# EAGLE design 611_jetbot (EAGLE 9.2.2)
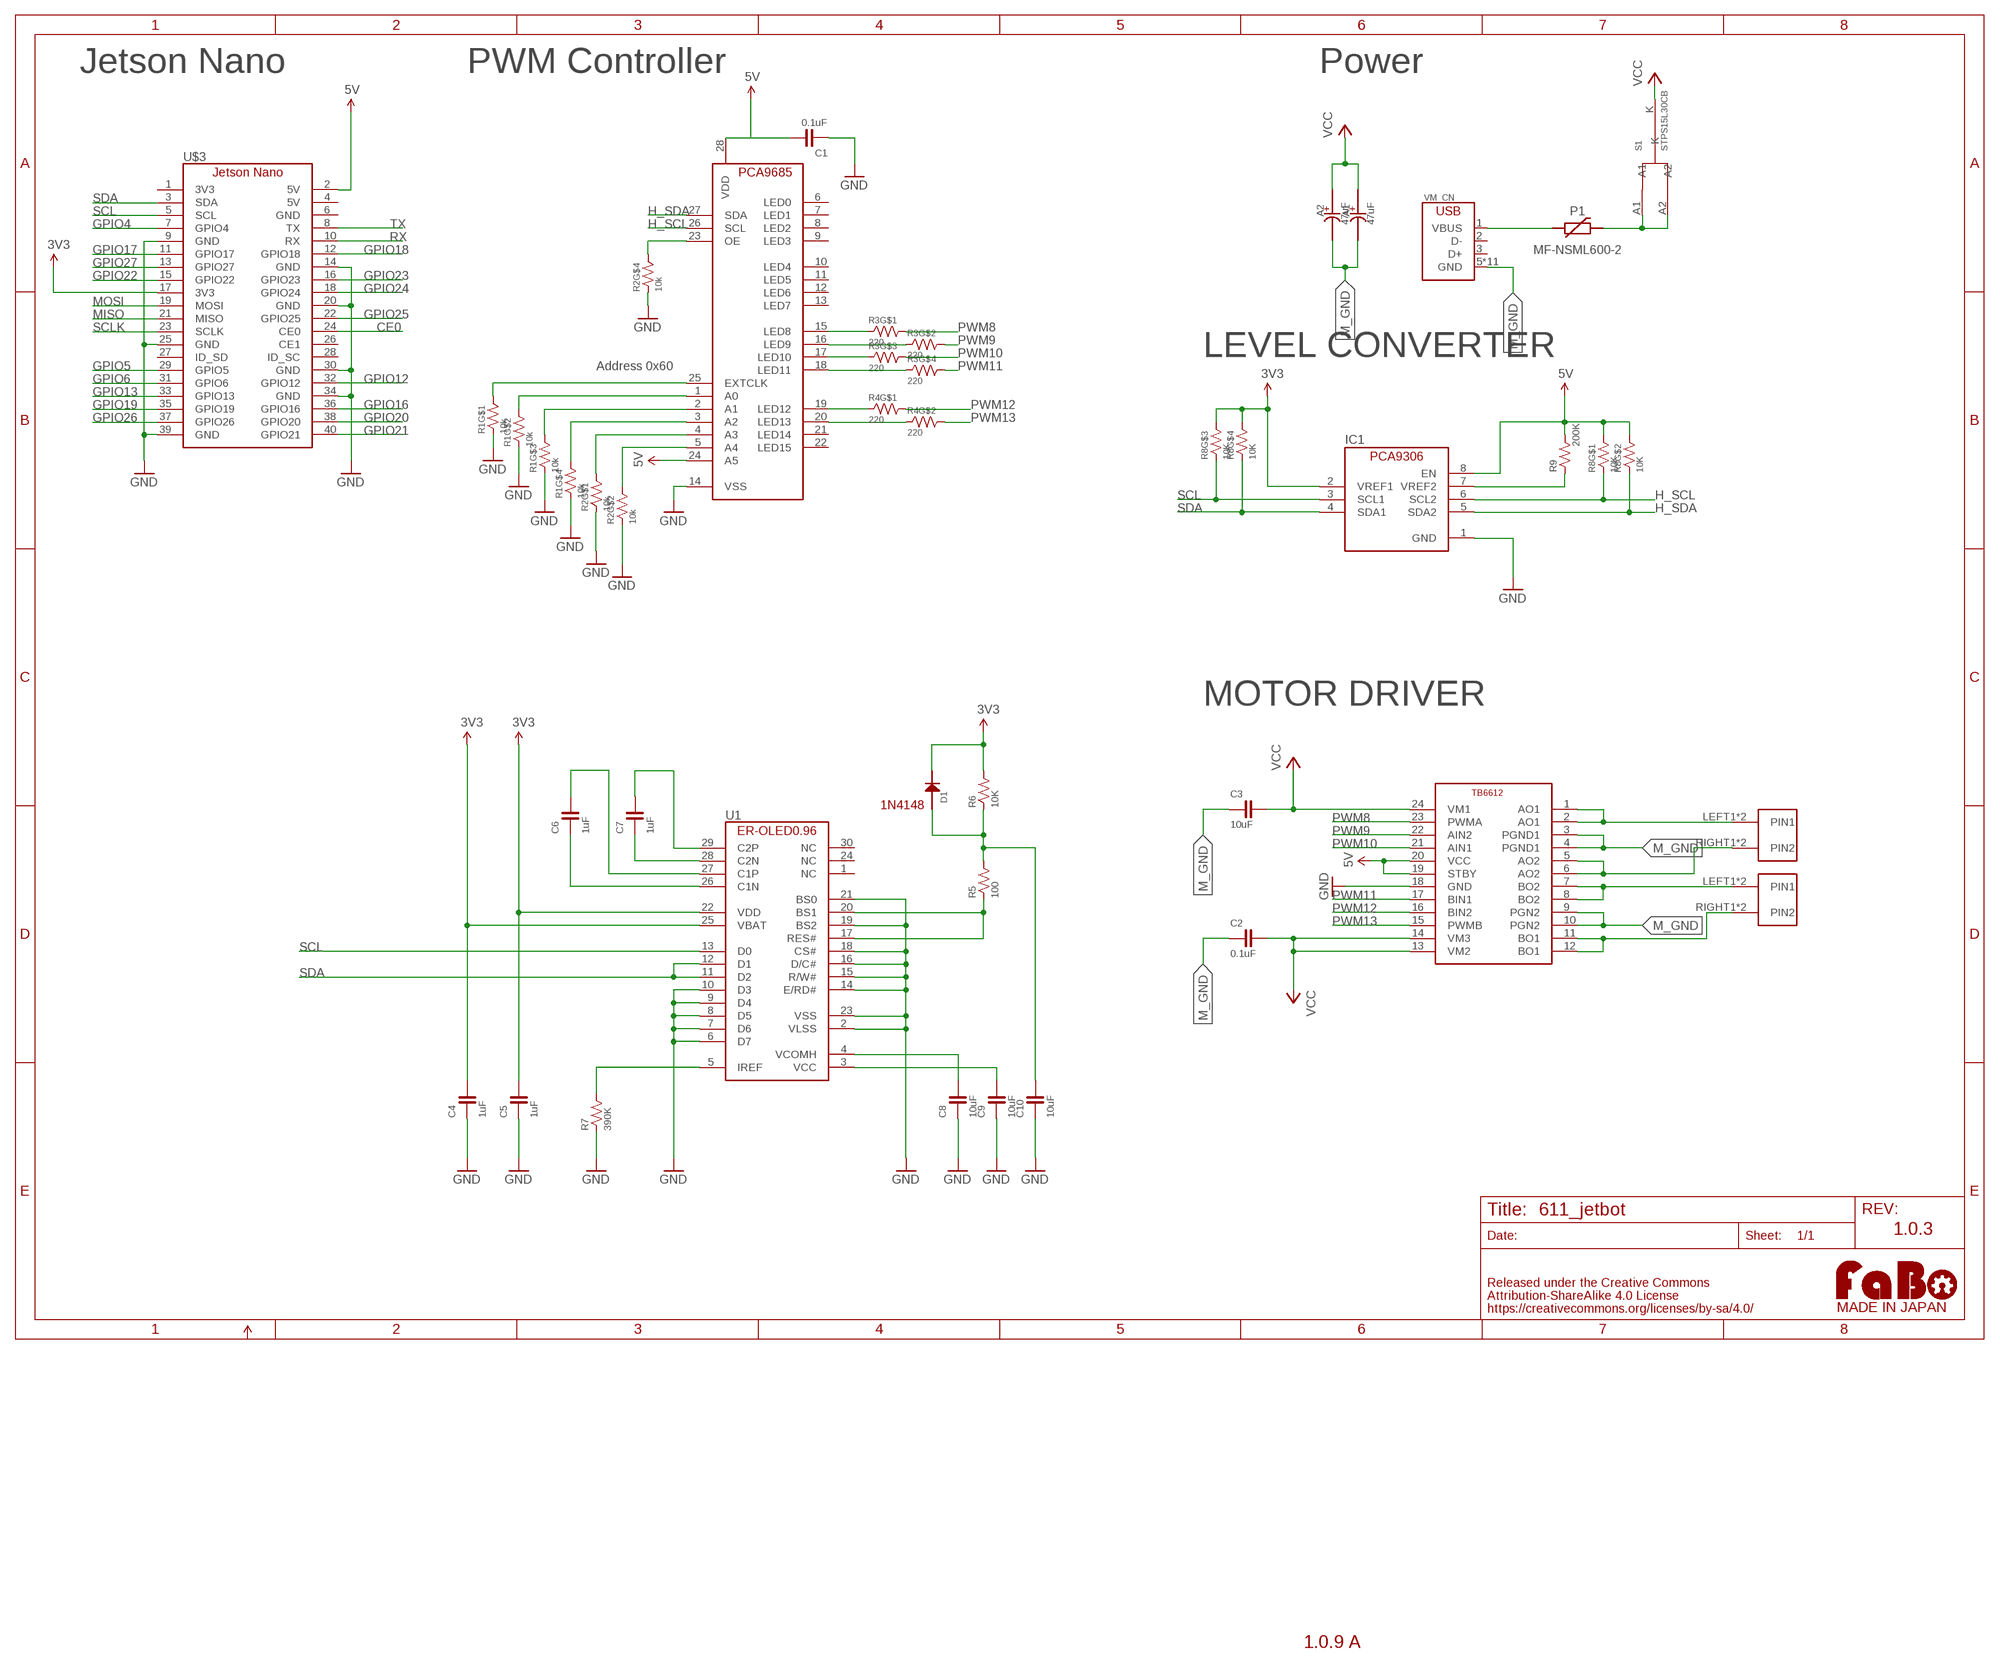
[diagram p0: schematic, sheet 1]

## Parts
A1  47uF  CAPACITOR-ALUMIN_D60  [D60]
A2  47uF  CAPACITOR-ALUMIN_D60  [D60]
C1  0.1uF  CAPACITOR-0603  [0603]
C2  0.1uF  CAPACITOR-0603  [0603]
C3  10uF  CAPACITOR-0603  [0603]
C4  1uF  CAPACITOR-0603-BOTTOM  [0603-BOTTOM]
C5  1uF  CAPACITOR-0603-BOTTOM  [0603-BOTTOM]
C6  1uF  CAPACITOR-0603-BOTTOM  [0603-BOTTOM]
C7  1uF  CAPACITOR-0603-BOTTOM  [0603-BOTTOM]
C8  10uF  CAPACITOR-0603-BOTTOM  [0603-BOTTOM]
C9  10uF  CAPACITOR-0603-BOTTOM  [0603-BOTTOM]
C10  10uF  CAPACITOR-0603-BOTTOM  [0603-BOTTOM]
D1  1N4148  [1N4148W]
IC1  PCA9306_SSOP  [8PIN-SSOP]
P1  MF-NSML600-2  POLYSWITCH1206  [1206]
R1  10k  RESISTOR_ARRAY  [EXBV8V]
R2  10k  RESISTOR_ARRAY  [EXBV8V]
R3  220  RESISTOR_ARRAY  [EXBV8V]
R4  220  RESISTOR_ARRAY  [EXBV8V]
R5  100  RESISTOR-0603-BOTTOM  [0603-BOTTOM]
R6  10K  RESISTOR-0603-BOTTOM  [0603-BOTTOM]
R7  390K  RESISTOR-0603-BOTTOM  [0603-BOTTOM]
R8  10K  RESISTOR_ARRAY  [EXBV8V]
R9  200K  RESISTOR-0603  [0603]
S1  STPS15L30CB  STPS15L30C  [STPS15L30C]
U1  ER-OLED0.96-1ER-CON30HT-1  [ER-CON30HT-1]
U$3  JETSON_NANO  [JETSON_NANO]
U$5  TB6612  [TB6612]
U$6  ML-1400-S1  [ML-1400-S1]
U$8  ML-1400-S1  [ML-1400-S1]
U$9  PCA9685  [PCA9685]
U$14  LOGO_FABO-M  [LOGO_FABO_MS]
VM_CN  USB-ZX62D  [ZX62D-B-5PA8]

## Nets
3V3: C4.2 D1.CATHODE IC1.2(VREF1) R6.2 R8.5 R8.6 U1.25(VBAT) U$3.17(3V3)
5V: C1.2 IC1.8(EN) R8.7 R8.8 R9.2 U$3.2(5V) U$5.19(STBY) U$5.20(VCC) U$9.24(A5) U$9.28(VDD)
CE0: U$3.24(CE0)
GND: C1.1 C4.1 C5.1 C8.1 C9.1 C10.1 IC1.1(GND) R1.1 R1.2 R1.3 R1.4 R2.1 R2.2 R2.4 R7.1 U1.2(VLSS) U1.6(D7) U1.7(D6) U1.8(D5) U1.9(D4) U1.10(D3) U1.14(E/RD#) U1.15(R/W#) U1.16(D/C#) U1.18(CS#) U1.19(BS2) U1.21(BS0) U1.23(VSS) U$3.9(GND) U$3.14(GND) U$3.20(GND) U$3.25(GND) U$3.30(GND) U$3.34(GND) U$3.39(GND) U$5.18(GND) U$9.14(VSS)
GPIO4: U$3.7(GPIO4)
GPIO5: U$3.29(GPIO5)
GPIO6: U$3.31(GPIO6)
GPIO12: U$3.32(GPIO12)
GPIO13: U$3.33(GPIO13)
GPIO16: U$3.36(GPIO16)
GPIO17: U$3.11(GPIO17)
GPIO18: U$3.12(GPIO18)
GPIO19: U$3.35(GPIO19)
GPIO20: U$3.38(GPIO20)
GPIO21: U$3.40(GPIO21)
GPIO22: U$3.15(GPIO22)
GPIO23: U$3.16(GPIO23)
GPIO24: U$3.18(GPIO24)
GPIO25: U$3.22(GPIO25)
GPIO26: U$3.37(GPIO26)
GPIO27: U$3.13(GPIO27)
H_SCL: IC1.6(SCL2) R8.1 U$9.26(SCL)
H_SDA: IC1.5(SDA2) R8.2 U$9.27(SDA)
M_GND: A1.MINUS(-) A2.MINUS(-) C2.1 C3.1 U$5.3(PGND1) U$5.4(PGND1) U$5.9(PGN2) U$5.10(PGN2) VM_CN.5(GND) VM_CN.B1(GND) VM_CN.B2(GND) VM_CN.B3(GND) VM_CN.B4(GND) VM_CN.T1(GND) VM_CN.T2(GND) VM_CN.T3(GND) VM_CN.T4(GND) VM_CN.T5(GND) VM_CN.T6(GND)
MISO: U$3.21(MISO)
MOSI: U$3.19(MOSI)
N$2: R3.1 U$9.15(LED8)
N$3: R3.2 U$9.16(LED9)
N$4: R3.3 U$9.17(LED10)
N$5: R3.4 U$9.18(LED11)
N$6: R4.1 U$9.19(LED12)
N$7: R2.5 U$9.23(OE)
N$8: R1.8 U$9.25(EXTCLK)
N$9: R1.7 U$9.1(A0)
N$10: R1.6 U$9.2(A1)
N$11: R1.5 U$9.3(A2)
N$12: R2.8 U$9.4(A3)
N$13: R2.7 U$9.5(A4)
N$14: C6.2 U1.27(C1P)
N$15: R4.2 U$9.20(LED13)
N$16: C6.1 U1.26(C1N)
N$17: U$5.1(AO1) U$5.2(AO1) U$6.LEFT1(PIN1) U$6.LEFT2(PIN1)
N$18: U$5.5(AO2) U$5.6(AO2) U$6.RIGHT1(PIN2) U$6.RIGHT2(PIN2)
N$19: C7.1 U1.28(C2N)
N$20: U$5.7(BO2) U$5.8(BO2) U$8.LEFT1(PIN1) U$8.LEFT2(PIN1)
N$21: C7.2 U1.29(C2P)
N$22: U$5.11(BO1) U$5.12(BO1) U$8.RIGHT1(PIN2) U$8.RIGHT2(PIN2)
N$23: R7.2 U1.5(IREF)
N$24: C8.2 U1.4(VCOMH)
N$25: C9.2 U1.3(VCC)
N$26: R5.1 U1.17(RES#) U1.20(BS1)
N$27: C10.2 D1.ANODE R5.2 R6.1
N$30: C5.2 U1.22(VDD) ; supply symbol labelled 3V3
N$33: IC1.7(VREF2) R9.1
PTCP1: P1.P$1 VM_CN.1(VBUS)
PTCP2: P1.P$2 S1.A1 S1.A2
PWM8: R3.8 U$5.23(PWMA)
PWM9: R3.7 U$5.22(AIN2)
PWM10: R3.6 U$5.21(AIN1)
PWM11: R3.5 U$5.17(BIN1)
PWM12: R4.8 U$5.16(BIN2)
PWM13: R4.7 U$5.15(PWMB)
RX: U$3.10(RX)
SCL: IC1.3(SCL1) R8.3 U1.13(D0) U$3.5(SCL)
SCLK: U$3.23(SCLK)
SDA: IC1.4(SDA1) R8.4 U1.11(D2) U1.12(D1) U$3.3(SDA)
TX: U$3.8(TX)
VCC: A1.PLUS(+) A2.PLUS(+) C2.2 C3.2 S1.K U$5.13(VM2) U$5.14(VM3) U$5.24(VM1)
Unconnected: R2.3 R2.6 R4.3 R4.4 R4.5 R4.6 U1.1(NC) U1.24(NC) U1.30(NC) U$3.1(3V3) U$3.4(5V) U$3.6(GND) U$3.26(CE1) U$3.27(ID_SD) U$3.28(ID_SC) U$9.6(LED0) U$9.7(LED1) U$9.8(LED2) U$9.9(LED3) U$9.10(LED4) U$9.11(LED5) U$9.12(LED6) U$9.13(LED7) U$9.21(LED14) U$9.22(LED15) VM_CN.2(D-) VM_CN.3(D+)

## Notes on the sheet
- Jetson Nano | PWM Controller | Power
- LEVEL CONVERTER
- Address 0x60
- MOTOR DRIVER
- 1N4148
- 1.0.3
- 1.0.9 A

## Library data of the parts
A1 A2 = FaBo-Capacitor:CAPACITOR-ALUMIN
C1-C10 = FaBo-Capacitor:CAPACITOR: CAPACITOR
D1 = FaBo-Diode:1N4148
IC1 = FaBo-LevelTranslator:PCA9306
P1 = FaBo-Supply:POLYSWITCH
R1-R4 R8 = component:RESISTOR_ARRAY
R5-R7 R9 = FaBo-Resistors:RESISTOR: RESISTOR
S1 = FaBo-Supply:STPS15L30C
U1 = FaBo-Display:ER-OLED0.96-1
U$3 = FaBo-Boards:JETSON_NANO
U$5 = FaBo-Motor:TB6612
U$6 U$8 = FaBo-Terminal:ML-1400-S1
U$9 = FaBo-Motor:PCA9685
U$14 = FaBo-etc:LOGO_FABO
VM_CN = component:USB

## Board
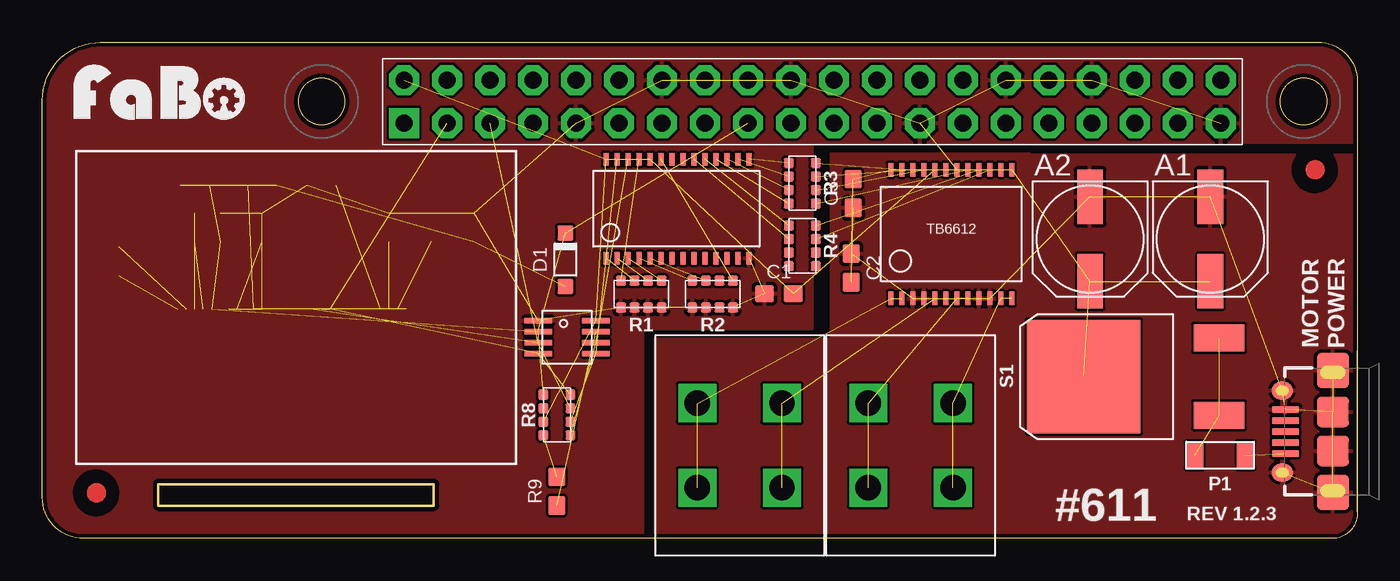
[diagram p1: board, top side]
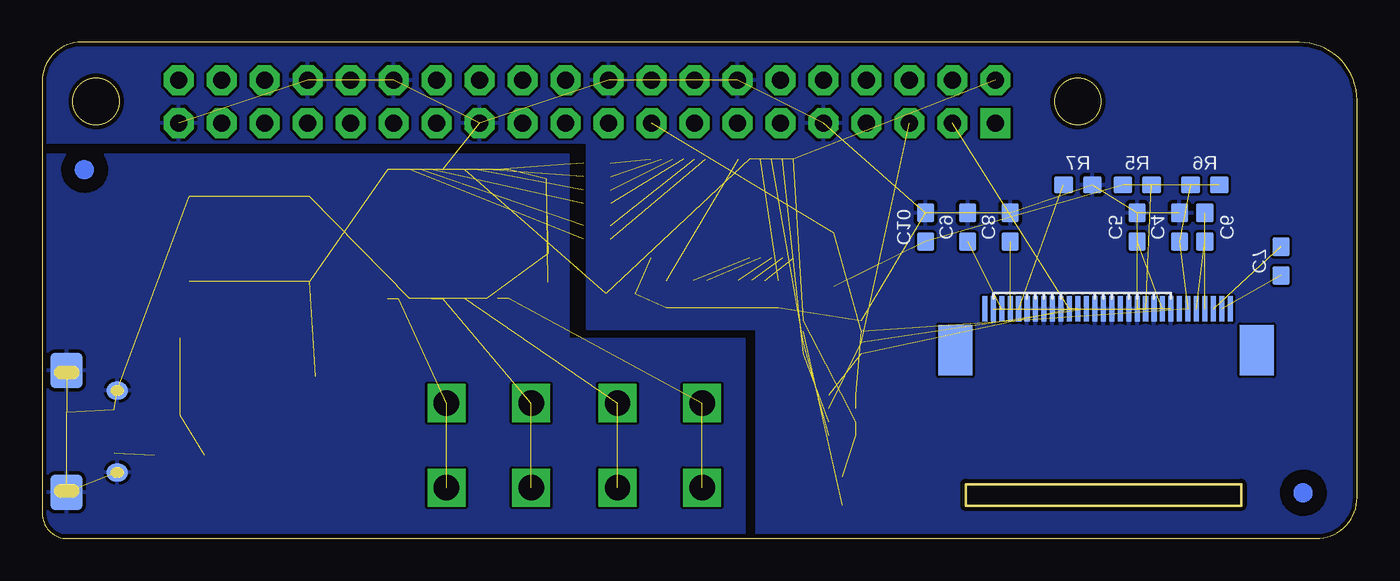
[diagram p2: board, bottom side, seen from below]

Size 77.68 x 29.33 mm. Coordinates in mm from the lower left corner, seen from the top.
Outline: 6.85,1.94 23.13,1.94 23.13,3.21 6.85,3.21 6.85,1.94
Copper layers (1*16): Top 0.035mm / dielectric 1.6mm / Bottom 0.035mm
Design rules "PCBway": minimum track width 6mil, minimum drill 12mil, track to track 6mil, track to pad 6mil, pad to pad 6mil, via to via 6mil, smd to smd 6mil, copper to edge 10mil, drill to drill 10mil, minimum pad ring 10mil, minimum via ring 6mil, stop-mask expansion 2mil, vias tented up to drill 100mil, thermal gap 8mil

### Footprints (pad centres in the part's own frame; a part is rotated, then mirrored left to right if it is on the bottom)
D60 = smd 3.2 x 1.524: MINUS -2.5,0; PLUS 2.5,0
0603 = smd 1.1 x 1: 1 -0.85,0; 2 0.85,0
0603-BOTTOM = smd 1.1 x 1 bottom: 1 -0.85,0; 2 0.85,0
1N4148W = smd 0.9 x 0.95: ANODE 0,0; CATHODE 3.15,0
8PIN-SSOP = smd 0.3 x 1.6: 1 -0.975,-1.7; 2 -0.325,-1.7; 3 0.325,-1.7; 4 0.975,-1.7; 5 0.975,1.7; 6 0.325,1.7; 7 -0.325,1.7; 8 -0.975,1.7
1206 = smd 1 x 1.6: P$1 -1.5,0; P$2 1.5,0
EXBV8V = smd 0.6 x 0.6: 1 -1.2,-0.8; 2 -0.4,-0.8; 3 0.4,-0.8; 4 1.2,-0.8; 5 1.2,0.8; 6 0.4,0.8; 7 -0.4,0.8; 8 -1.2,0.8
STPS15L30C = smd 1.6 x 3: A1 -2.286,-6.13; A2 2.286,-6.13 | smd 6.7 x 6.7: K 0,1.87
ER-CON30HT-1 = smd 0.3 x 1.5 bottom: 1 7,-0.23; 2 6.5,-0.23; 3 6,-0.23; 4 5.5,-0.23; 5 5,-0.23; 6 4.5,-0.23; 7 4,-0.23; 8 3.5,-0.23; 9 3,-0.23; 10 2.5,-0.23; 11 2,-0.23; 12 1.5,-0.23; 13 1,-0.23; 14 0.5,-0.23; 15 0,-0.23; 16 -0.5,-0.23; 17 -1,-0.23; 18 -1.5,-0.23; 19 -2,-0.23; 20 -2.5,-0.23; 21 -3,-0.23; 22 -3.5,-0.23; 23 -4,-0.23; 24 -4.5,-0.23; 25 -5,-0.23; 26 -5.5,-0.23; 27 -6,-0.23; 28 -6.5,-0.23; 29 -7,-0.23; 30 -7.5,-0.23 | smd 2 x 3 bottom: 31 -9.07,-2.67; 32 8.74,-2.67
JETSON_NANO = drill 1 pad 1.778 square: 1 -24.13,10.16 | drill 1 pad 1.778 octagon: 2 -24.13,12.7; 3 -21.59,10.16; 4 -21.59,12.7; 5 -19.05,10.16; 6 -19.05,12.7; 7 -16.51,10.16; 8 -16.51,12.7; 9 -13.97,10.16; 10 -13.97,12.7; 11 -11.43,10.16; 12 -11.43,12.7; 13 -8.89,10.16; 14 -8.89,12.7; 15 -6.35,10.16; 16 -6.35,12.7; 17 -3.81,10.16; 18 -3.81,12.7; 19 -1.27,10.16; 20 -1.27,12.7; 21 1.27,10.16; 22 1.27,12.7; 23 3.81,10.16; 24 3.81,12.7; 25 6.35,10.16; 26 6.35,12.7; 27 8.89,10.16; 28 8.89,12.7; 29 11.43,10.16; 30 11.43,12.7; 31 13.97,10.16; 32 13.97,12.7; 33 16.51,10.16; 34 16.51,12.7; 35 19.05,10.16; 36 19.05,12.7; 37 21.59,10.16; 38 21.59,12.7; 39 24.13,10.16; 40 24.13,12.7
TB6612 = smd 0.3 x 0.8: 1 -3.575,-3.8; 2 -2.925,-3.8; 3 -2.275,-3.8; 4 -1.625,-3.8; 5 -0.975,-3.8; 6 -0.325,-3.8; 7 0.325,-3.8; 8 0.975,-3.8; 9 1.625,-3.8; 10 2.275,-3.8; 11 2.925,-3.8; 12 3.575,-3.8; 13 3.575,3.8; 14 2.925,3.8; 15 2.275,3.8; 16 1.625,3.8; 17 0.975,3.8; 18 0.325,3.8; 19 -0.325,3.8; 20 -0.975,3.8; 21 -1.625,3.8; 22 -2.275,3.8; 23 -2.925,3.8; 24 -3.575,3.8
ML-1400-S1 = drill 1.5 square: LEFT1 -2.5,2.5; LEFT2 -2.5,-2.5; RIGHT1 2.5,2.5; RIGHT2 2.5,-2.5
PCA9685 = smd 0.3 x 0.75: 1 -4.15,-2.93; 2 -3.5,-2.93; 3 -2.85,-2.93; 4 -2.2,-2.93; 5 -1.55,-2.93; 6 -0.9,-2.93; 7 -0.25,-2.93; 8 0.4,-2.93; 9 1.05,-2.93; 10 1.7,-2.93; 11 2.35,-2.93; 12 3,-2.93; 13 3.65,-2.93; 14 4.3,-2.93; 15 4.3,2.92; 16 3.65,2.92; 17 3,2.92; 18 2.35,2.92; 19 1.7,2.92; 20 1.05,2.92; 21 0.4,2.92; 22 -0.25,2.92; 23 -0.9,2.92; 24 -1.55,2.92; 25 -2.2,2.92; 26 -2.85,2.92; 27 -3.5,2.92; 28 -4.15,2.92
ZX62D-B-5PA8 = smd 0.4 x 1.6: 1 -1.3,4.25; 2 -0.65,4.25; 3 0,4.25; 4 0.65,4.25; 5 1.3,4.25 | smd 1.05 x 1.25 bottom: B1 -2.425,4.45; B2 2.425,4.45 | smd 2.1 x 1.9 bottom: B3 -3.6,1.45; B4 3.6,1.45 | smd 1.05 x 1.25: T1 -2.425,4.45; T2 2.425,4.45 | smd 2.1 x 1.9: T3 -3.6,1.45; T6 3.6,1.45 | smd 1.8 x 1.9: T4 -1.15,1.45; T5 1.15,1.45

### Placement (x,y rotation side)
A1  69,17.7 270 top
A2  61.9,17.7 270 top
C1  43.52,14.47 0 top
C2  47.8,16 270 top
C3  47.9,20.4 90 top
C4  10.5,18.4 270 top
C5  13,18.4 270 top
C6  9,18.4 90 top
C7  4.5,16.4 270 top
C8  20.5,18.4 270 top
C9  23,18.4 270 top
C10  25.5,18.4 270 top
D1  30.9,14.9 90 top
IC1  31,11.9 270 top
P1  69.58,4.92 180 top
R1  35.39,14.44 0 top
R2  39.6,14.44 0 top
R3  44.9,21 270 top
R4  44.9,17.3 270 top
R5  13,20.9 0 top
R6  9,20.9 0 top
R7  16.5,20.9 0 top
R8  30.4,7.3 90 top
R9  30.4,2.8 90 top
S1  63.39,9.57 90 top
U1  15,13.8 0 top
U$2  [MARK_POINT_3MM]  3.2,2.7 0 top
U$3  45.5,14.4 0 top
U$4  [MARK_POINT_3MM]  75.2,21.8 0 top
U$5  53.7,18 0 top
U$6  41.2,5.5 0 top
U$7  [MARK_POINT_3MM_BOTTOM]  3.2,2.7 0 top
U$8  51.3,5.5 0 top
U$9  37.45,19.49 0 top
U$10  [MARK_POINT_3MM_BOTTOM]  75.2,21.8 0 top
U$14  6.92,24.38 0 top
VM_CN  77.7,6.32 90 top

### Tracks (layer width: path | path; a pad name or v marks a point on that pad's centre or on a via)
3V3  (7 unrouted)
5V  (9 unrouted)
GND  (36 unrouted)
  pour Top: -0.5,-1.6 35.5,-1.6 35.5,12.4 45.5,12.4 45.5,23.4 77.5,23.4 77.5,30.4 -0.5,30.4
  pour Bottom: -0.5,-1.6 35.5,-1.6 35.5,12.4 45.5,12.4 45.5,23.4 77.5,23.4 77.5,30.4 -0.5,30.4
H_SCL  (2 unrouted)
H_SDA  (2 unrouted)
M_GND  (18 unrouted)
  pour Top: 46.6,22.75 58.3,22.75 58.3,22.7 78.5,22.7 78.5,-1.1 36.2,-1.1 36.2,11.8 46.6,11.8
  pour Bottom: 36.2,11.8 46.6,11.8 46.6,22.7 77.5,22.7 77.5,-0.4 77.4,-0.5 36.2,-0.5
N$2  (1 unrouted)
N$3  (1 unrouted)
N$4  (1 unrouted)
N$5  (1 unrouted)
N$6  (1 unrouted)
N$7  (1 unrouted)
N$8  (1 unrouted)
N$9  (1 unrouted)
N$10  (1 unrouted)
N$11  (1 unrouted)
N$12  (1 unrouted)
N$13  (1 unrouted)
N$14  (1 unrouted)
N$15  (1 unrouted)
N$16  (1 unrouted)
N$17  (3 unrouted)
N$18  (3 unrouted)
N$19  (1 unrouted)
N$20  (3 unrouted)
N$21  (1 unrouted)
N$22  (3 unrouted)
N$23  (1 unrouted)
N$24  (1 unrouted)
N$25  (1 unrouted)
N$26  (2 unrouted)
N$27  (3 unrouted)
N$30  (1 unrouted)
N$33  (1 unrouted)
PTCP1  (1 unrouted)
PTCP2  (2 unrouted)
PWM8  (1 unrouted)
PWM9  (1 unrouted)
PWM10  (1 unrouted)
PWM11  (1 unrouted)
PWM12  (1 unrouted)
PWM13  (1 unrouted)
SCL  (3 unrouted)
SDA  (4 unrouted)
VCC  (7 unrouted)

### Text on the board
tPlace: MOTOR / POWER | #611 | REV 1.2.3